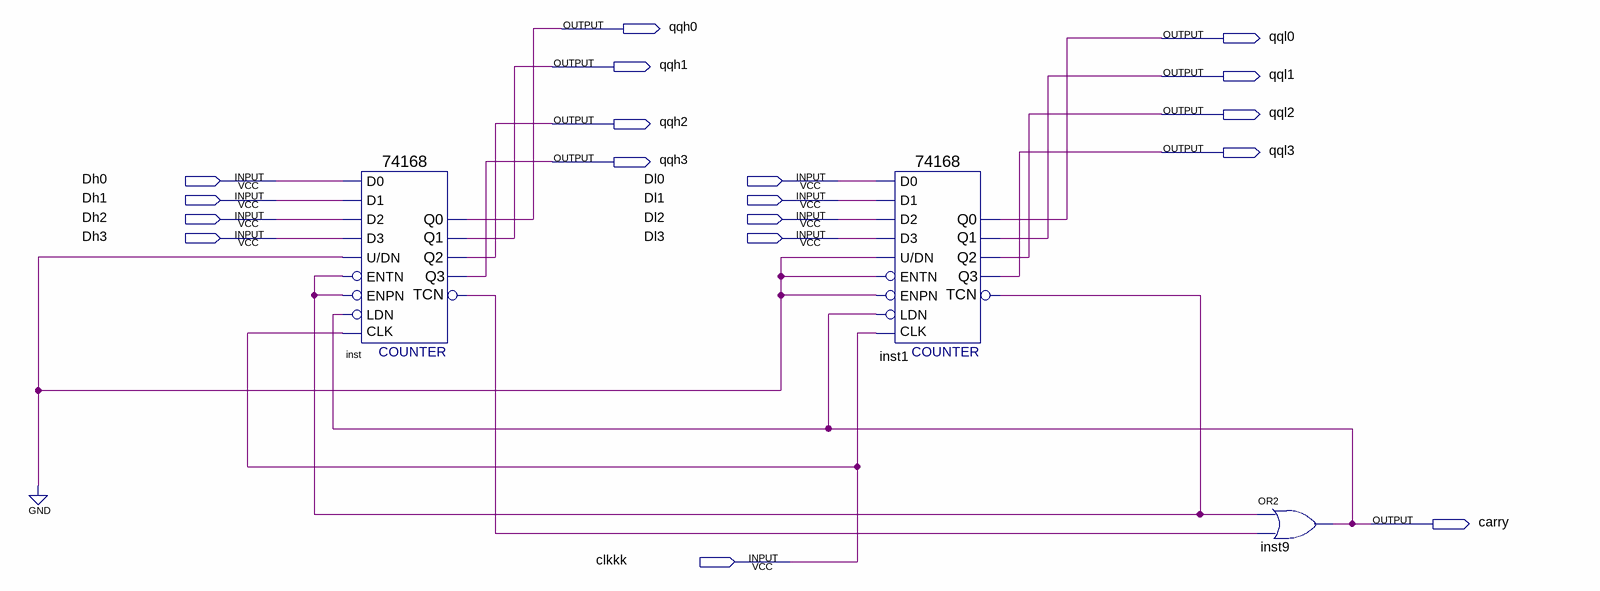
[diagram p0: schematic sheet]
// Quartus schematic counter3.bdf as structural Verilog: 3 symbols, 18 pins
module counter3 (
  input  Dh0,
  input  Dl0,
  input  Dh1,
  input  Dl1,
  input  Dh2,
  input  Dl2,
  input  Dh3,
  input  Dl3,
  input  clkkk,
  output qqh0,
  output qql0,
  output qqh1,
  output qql1,
  output qql2,
  output qqh2,
  output qql3,
  output qqh3,
  output carry
);

  wire inst1_tcn, inst_tcn;

  \74168  inst (
    .D0(Dh0), .D1(Dh1), .D2(Dh2), .D3(Dh3), .\U/DN (1'b0), .ENPN(inst1_tcn), .CLK(clkkk), .ENTN(inst1_tcn),
    .LDN(carry), .Q3(qqh3), .TCN(inst_tcn), .Q1(qqh1), .Q0(qqh0), .Q2(qqh2));
  \74168  inst1 (
    .D0(Dl0), .D1(Dl1), .D2(Dl2), .D3(Dl3), .\U/DN (1'b0), .ENPN(1'b0), .CLK(clkkk), .ENTN(1'b0),
    .LDN(carry), .Q3(qql3), .TCN(inst1_tcn), .Q1(qql1), .Q0(qql0), .Q2(qql2));
  or inst9 (carry, inst1_tcn, inst_tcn);
endmodule
